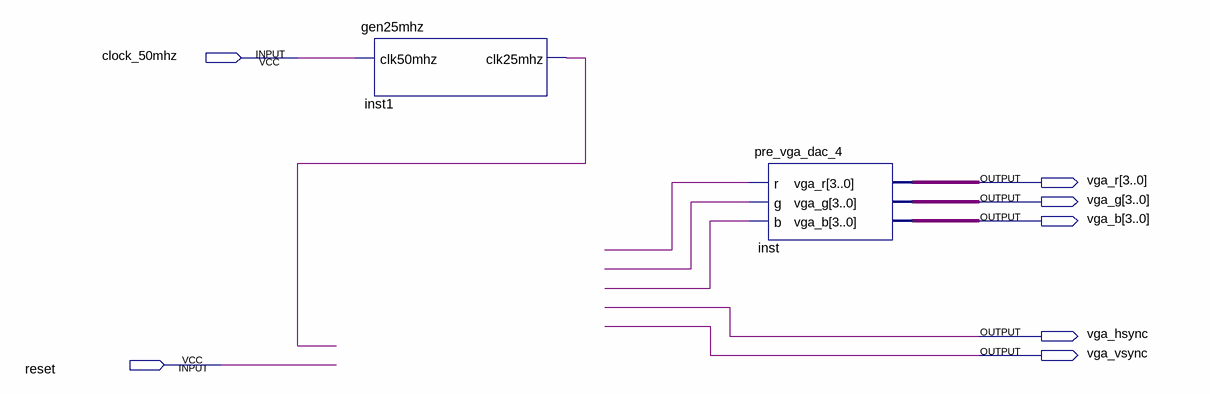
[diagram p0: schematic sheet]
// Quartus schematic top_de1.bdf as structural Verilog: 2 symbols, 7 pins
module top_de1 (
  input  clock_50mhz,
  input  reset,
  output [3:0] vga_r,
  output [3:0] vga_g,
  output [3:0] vga_b,
  output vga_hsync,
  output vga_vsync
);

  wire inst1_clk25mhz, undriven, undriven_2, undriven_3;

  gen25mhz inst1 (.clk50mhz(clock_50mhz), .clk25mhz(inst1_clk25mhz));
  pre_vga_dac_4 inst (.r(undriven), .g(undriven_2), .b(undriven_3), .vga_r(vga_r), .vga_g(vga_g), .vga_b(vga_b));
endmodule
